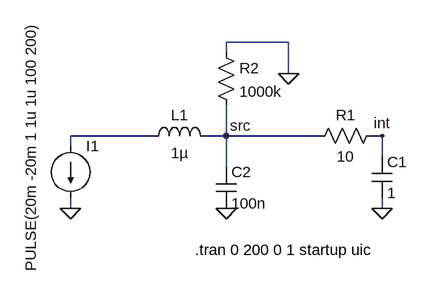
[diagram p0: schematic RC_load_first_order.asc]
RC_load_first_order.asc, the LTspice schematic file:
Version 4
SHEET 1 880 680
WIRE 112 -144 16 -144
WIRE 16 -128 16 -144
WIRE 112 -96 112 -144
WIRE -96 0 -224 0
WIRE 16 0 16 -48
WIRE 16 0 -16 0
WIRE 160 0 16 0
WIRE 256 0 240 0
WIRE -224 16 -224 0
WIRE 256 32 256 0
WIRE 16 48 16 0
WIRE -224 112 -224 96
WIRE 256 112 256 96
FLAG 256 112 0
FLAG -224 112 0
FLAG 16 0 src
FLAG 256 0 int
FLAG 112 -96 0
FLAG 16 112 0
SYMBOL res 256 -16 R90
WINDOW 0 0 56 VBottom 2
WINDOW 3 32 56 VTop 2
SYMATTR InstName R1
SYMATTR Value 10
SYMBOL cap 240 32 R0
SYMATTR InstName C1
SYMATTR Value 1
SYMBOL current -224 16 R0
WINDOW 3 -61 193 VLeft 2
WINDOW 123 0 0 Left 0
WINDOW 39 -33 193 VLeft 2
SYMATTR InstName I1
SYMATTR Value PULSE(20m -20m 1 1u 1u 100 200)
SYMBOL res 0 -144 R0
SYMATTR InstName R2
SYMATTR Value 1000k
SYMBOL cap 0 48 R0
SYMATTR InstName C2
SYMATTR Value 100n
SYMBOL ind -112 16 R270
WINDOW 0 32 56 VTop 2
WINDOW 3 5 56 VBottom 2
SYMATTR InstName L1
SYMATTR Value 1µ
SYMATTR SpiceLine Rser=0.1
TEXT -32 176 Left 2 !.tran 0 200 0 1 startup uic

The netlist it stands for:
* RC_load_first_order.asc
R1 int src 10
C1 int 0 1
I1 N001 0 PULSE(20m -20m 1 1u 1u 100 200)
R2 0 src 1000k
C2 src 0 100n
L1 N001 src 1µ Rser=0.1
.tran 0 200 0 1 startup uic
.backanno
.end